# Altium schematic sheet activity_tracker.SchDoc: Activity Tracker - Main
size A4; DrawnBy: Lukas Gasser; DocumentNumber: 1; SheetNumber: 1; SheetTotal: 3
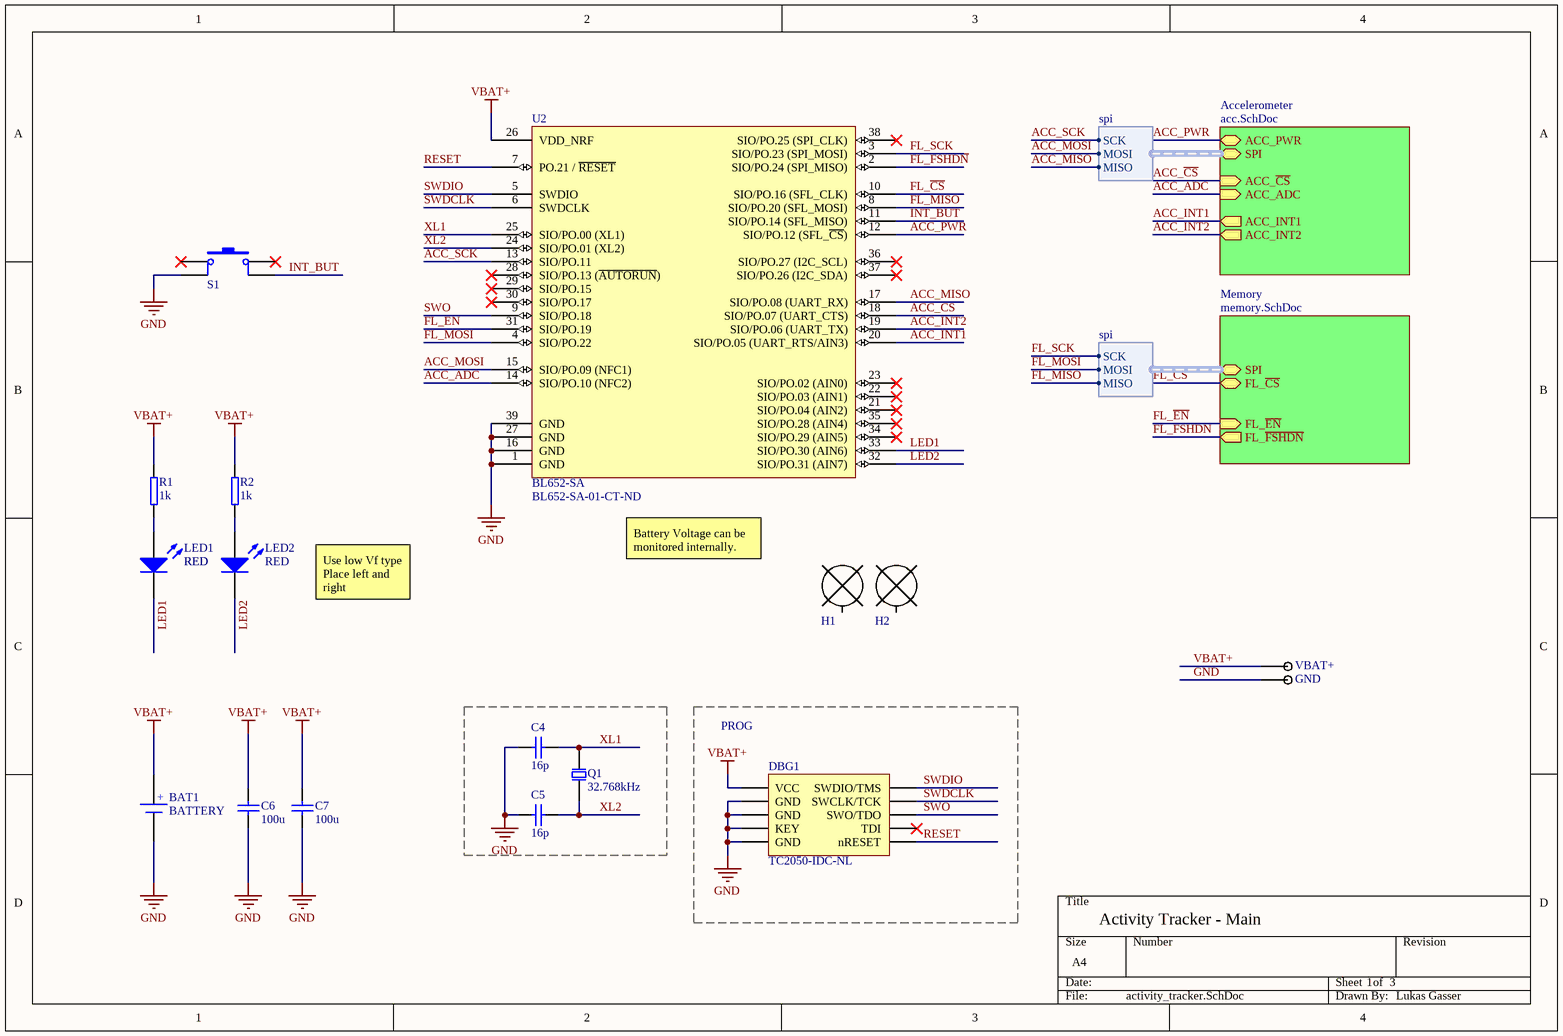
[diagram p0: activity_tracker.SchDoc]

## Parts
BAT1  BATTERY  [BK-912_MIN_FP]
C4  16p  [CAPC1608X95N]
C5  16p  [CAPC1608X95N]
C6  100u  [CAPC3216X18N]
C7  100u  [CAPC3216X18N]
DBG1  TC2050-IDC-NL  [TC2050-IDC-NL]
GND  Testpoint  [POGO1]  (value not drawn)  (no BOM)
H1  HOLE  [M1_SMALL_NOKEEPOUT]  (value not drawn)  (no BOM)
H2  HOLE  [M1_SMALL_NOKEEPOUT]  (value not drawn)  (no BOM)
LED1  RED  [LED0603]
LED2  RED  [LED0603]
Q1  32.768kHz  [ABS06]
R1  1k  [RESC1608X55N]
R2  1k  [RESC1608X55N]
S1  SW-PB-4T  [TL3315NF250Q]  (value not drawn)
U2  BL652-SA  Supplier Part Number 1: BL652-SA-01-CT-ND  [BL652-SA_NO_KEEPOUT]
VBAT+  Testpoint  [POGO1]  (value not drawn)  (no BOM)

## Blocks framed on the sheet
PROG: DBG1

## Sub-sheets
Accelerometer = acc.SchDoc: SPI (harness spi), ACC_~{CS} (in), ACC_INT1 (out), ACC_INT2 (out), ACC_ADC (in), ACC_PWR
Memory = memory.SchDoc: SPI (harness spi), FL_~{CS}, FL_~{EN} (in), FL_~{FSHDN} (out)

## Harnesses
spi: MISO, SCK, MOSI

## Nets
GND: BAT1.- C4.1 C5.1 C6.1 C7.1 DBG1.3(GND) DBG1.5(GND) DBG1.7(KEY) DBG1.9(GND) GND.1 S1.2 U2.1(GND) U2.16(GND) U2.27(GND) U2.39(GND)
VBAT+: BAT1.+ C6.2 C7.2 DBG1.1(VCC) R1.2 R2.2 U2.26(VDD_NRF) VBAT+.1
ACC_ADC: U2.14(SIO/PO.10_(NFC2)) ; sheet Accelerometer/ACC_ADC
ACC_~{CS}: U2.18(SIO/PO.07_(UART_CTS)) ; sheet Accelerometer/ACC_~{CS}
ACC_INT1: U2.20(SIO/PO.05_(UART_RTS/AIN3)) ; sheet Accelerometer/ACC_INT1
ACC_INT2: U2.19(SIO/PO.06_(UART_TX)) ; sheet Accelerometer/ACC_INT2
ACC_MISO: U2.17(SIO/PO.08_(UART_RX)) ; sheet Accelerometer/SPI.MISO
ACC_MOSI: U2.15(SIO/PO.09_(NFC1)) ; sheet Accelerometer/SPI.MOSI
ACC_PWR: U2.12(SIO/PO.12_(SFL_~{CS})) ; sheet Accelerometer/ACC_PWR
ACC_SCK: U2.13(SIO/PO.11) ; sheet Accelerometer/SPI.SCK
FL_~{CS}: U2.10(SIO/PO.16_(SFL_CLK)) ; sheet Memory/FL_~{CS}
FL_~{EN}: U2.31(SIO/PO.19) ; sheet Memory/FL_~{EN}
FL_~{FSHDN}: U2.2(SIO/PO.24_(SPI_MISO)) ; sheet Memory/FL_~{FSHDN}
FL_MISO: U2.8(SIO/PO.20_(SFL_MOSI)) ; sheet Memory/SPI.MISO
FL_MOSI: U2.4(SIO/PO.22) ; sheet Memory/SPI.MOSI
FL_SCK: U2.3(SIO/PO.23_(SPI_MOSI)) ; sheet Memory/SPI.SCK
INT_BUT: S1.4 U2.11(SIO/PO.14_(SFL_MISO))
LED1: LED1.2(K) U2.33(SIO/PO.30_(AIN6))
LED2: LED2.2(K) U2.32(SIO/PO.31_(AIN7))
RESET: DBG1.10(nRESET) U2.7(PO.21_/_~{RESET})
SWDCLK: DBG1.4(SWCLK/TCK) U2.6(SWDCLK)
SWDIO: DBG1.2(SWDIO/TMS) U2.5(SWDIO)
SWO: DBG1.6(SWO/TDO) U2.9(SIO/PO.18)
XL1: C4.2 Q1.2 U2.25(SIO/PO.00_(XL1))
XL2: C5.2 Q1.1 U2.24(SIO/PO.01_(XL2))
NetLED1_1: LED1.1(A) R1.1
NetLED2_1: LED2.1(A) R2.1

Not connected (* = marked no-connect by the designer): DBG1 8(TDI)*; H1 H; H2 H; S1 1* 3*; U2 21(SIO/PO.04_(AIN2))* 22(SIO/PO.03_(AIN1))* 23(SIO/PO.02_(AIN0))* 28(SIO/PO.13_(~{AUTORUN}))* 29(SIO/PO.15)* 30(SIO/PO.17)* 34(SIO/PO.29_(AIN5))* 35(SIO/PO.28_(AIN4))* 36(SIO/PO.27_(I2C_SCL))* 37(SIO/PO.26_(I2C_SDA))* 38(SIO/PO.25_(SPI_CLK))*

## Notes on the sheet
- Battery Voltage can be monitored internally.
- Use low Vf type
  Place left and right

## Library data of the parts
C4 C5 = C: Capacitor; Voltage: 50V; Value: 16p; Supplier 1: Digi-Key; Supplier Part Number 1: 1276-2204-1-ND; ClassName: ignoreSilkscreen
C6 C7 = C: Capacitor; Voltage: 6V3; Value: 100u; Supplier 1: Digi-Key; Supplier Part Number 1: 490-10525-1-ND
DBG1 = TC2050-IDC-NL: ARM Mini JTAG / SWD 10-pin connector; Supplier 1: Digi-Key; Supplier Part Number 1: TC2050-IDC-NL-ND
LED1 LED2 = LED: Color: RED; Supplier 1: Digi-Key; Supplier Part Number 1: 754-1541-1-ND
Q1 = Q-0Shield: Crystal; Frequency: 32.768kHz; PartNumber: *; ClassName: directConnect,ignoreSilkscreen; Supplier 1: Digi-Key; Supplier Part Number 1: 535-10247-1-ND
R1 R2 = R: Resistor; Value: 1k; Supplier 1: Digi-Key; Supplier Part Number 1: 1276-5062-1-ND
S1 = SW-PB-4T: Tact switch; ClassName: directConnect; Supplier 1: Digi-Key; Supplier Part Number 1: EG4622CT-ND
U2 = BL652-SA: RF TXRX MOD BLUETOOTH INT ANT; Supplier 1: Digi-Key
BAT1 = BATTERY: ClassName: directConnect; Supplier 1: Digi-Key; Supplier Part Number 1: BK-912-G-CT-ND
GND VBAT+ = Testpoint: ClassName: directConnect
H1 H2 = HOLE: ClassName: directConnect